# Altium schematic sheet 600W INV MCU-1.SchDoc
size 431 x 304 mm
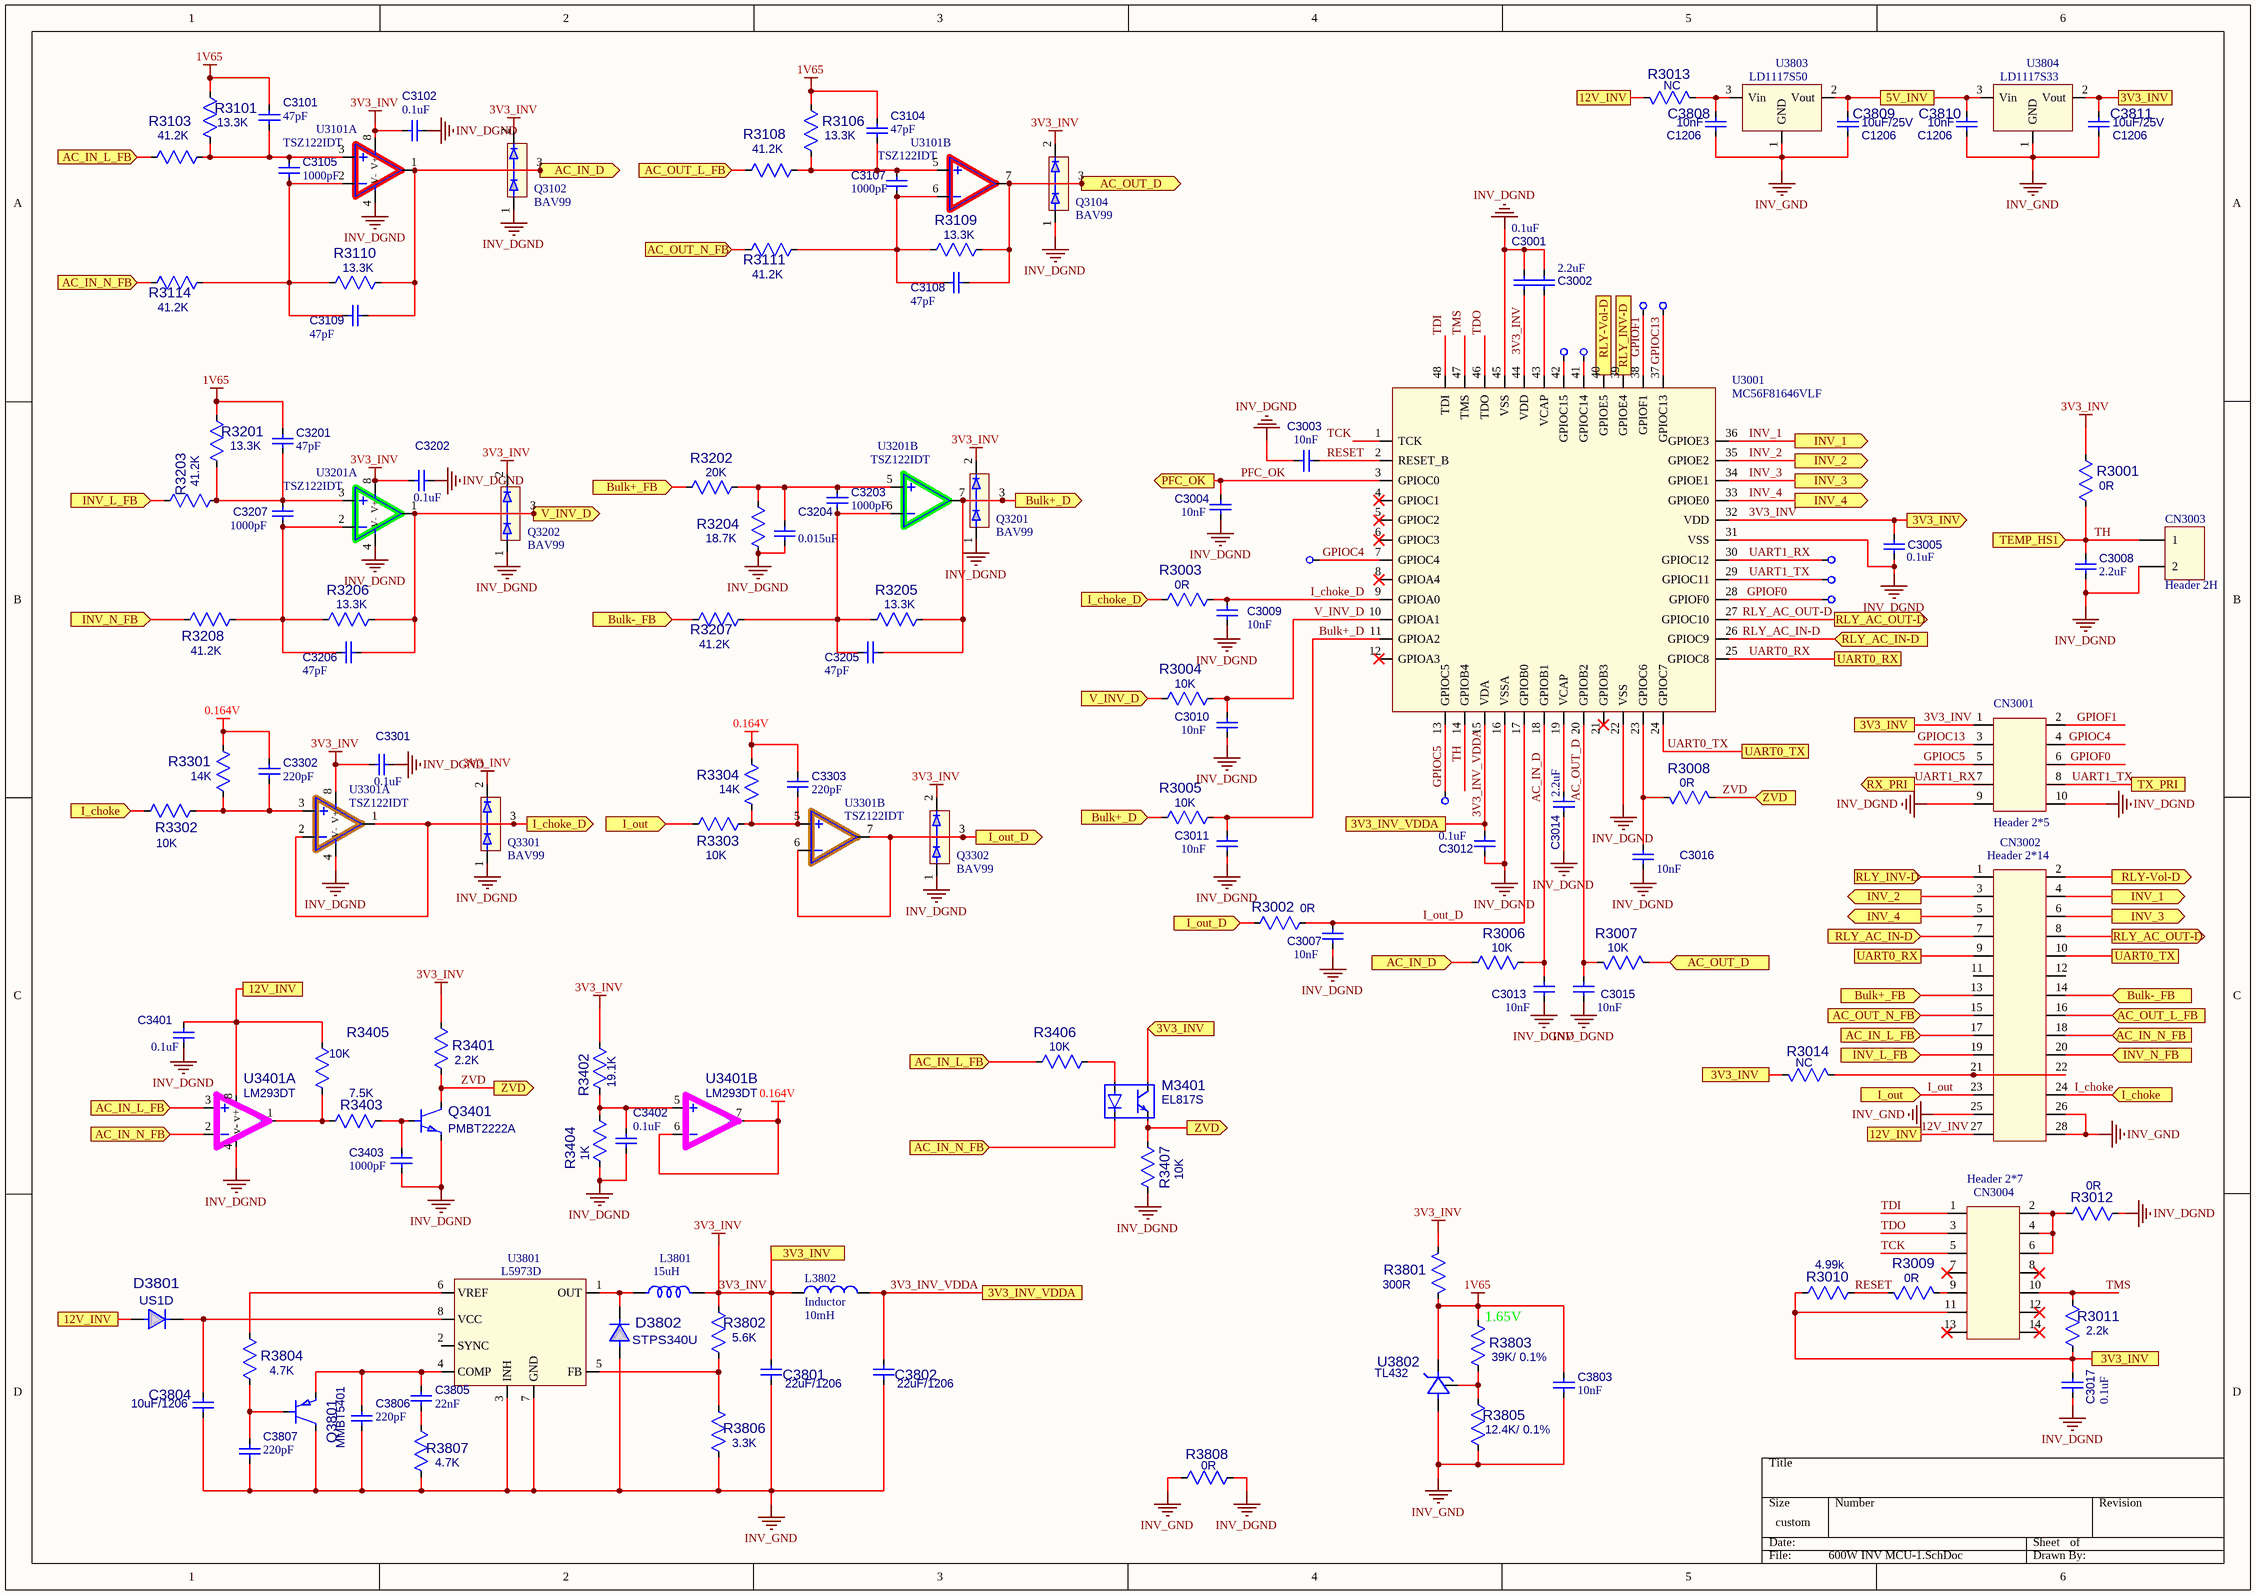
[diagram p0: 600W INV MCU-1.SchDoc]

## Parts
C3001  0.1uF  [C0603L]
C3002  2.2uF  [C0603L]
C3003  10nF  [C0603L]
C3004  10nF  [C0603L]
C3005  0.1uF  [C0603L]
C3007  10nF  [C0603L]
C3008  2.2uF  [C0603L]
C3009  10nF  [C0603L]
C3010  10nF  [C0603L]
C3011  10nF  [C0603L]
C3012  0.1uF  [C0603L]
C3013  10nF  [C0603L]
C3014  2.2uF  [C0603L]
C3015  10nF  [C0603L]
C3016  10nF  [C0603L]
C3017  0.1uF  [C0603L]
C3101  47pF  [C0603L]
C3102  0.1uF  [C0603L]
C3104  47pF  [C0603L]
C3105  1000pF  [C0603L]
C3107  1000pF  [C0603L]
C3108  47pF  [C0603L]
C3109  47pF  [C0603L]
C3201  47pF  [C0603L]
C3202  0.1uF  [C0603L]
C3203  1000pF  [C0603L]
C3204  0.015uF  [C0603L]
C3205  47pF  [C0603L]
C3206  47pF  [C0603L]
C3207  1000pF  [C0603L]
C3301  0.1uF  [C0603L]
C3302  220pF  [C0603L]
C3303  220pF  [C0603L]
C3401  0.1uF  [C0603L]
C3402  0.1uF  [C0603L]
C3403  1000pF  [C0603L]
C3801  22uF/1206  [C1206]
C3802  22uF/1206  [C1206]
C3803  10nF  [C0603L]
C3804  10uF/1206  [C1206]
C3805  22nF  [C0603L]
C3806  220pF  [C0603L]
C3807  220pF  [C0603L]
C3808  10nF  [C1206]
C3809  10uF/25V  [C1206]
C3810  10nF  [C1206]
C3811  10uF/25V  [C1206]
CN3001  Header 2*5  [HDR2X5]
CN3002  Header 2*14  [HDR2X14H]
CN3003  Header 2H  [HDR1X2H]
CN3004  Header 2*7  [HDR2X7]
D3801  US1D  [SMA]
D3802  STPS340U  [SMB]
L3801  15uH  [L-6*6]
L3802  Inductor  value 10mH  [R0603L]
M3401  EL817S  [PHOTO-PS2561DLA]
Q3102  BAV99  [SOT23]
Q3104  BAV99  [SOT23]
Q3201  BAV99  [SOT23]
Q3202  BAV99  [SOT23]
Q3301  BAV99  [SOT23]
Q3302  BAV99  [SOT23]
Q3401  PMBT2222A  [SOT23-CBE]
Q3801  MMBT5401  [SOT23]
R3001  0R  [R0603L]
R3002  0R  [R0603L]
R3003  0R  [R0603L]
R3004  10K  [R0603L]
R3005  10K  [R0603L]
R3006  10K  [R0603L]
R3007  10K  [R0603L]
R3008  0R  [R0603L]
R3009  0R  [R0603L]
R3010  4.99k  [R0603L]
R3011  2.2k  [R0603L]
R3012  0R  [R0603L]
R3013  NC  [R0603L]
R3014  NC  [R0603L]
R3101  13.3K  [R0603L]
R3103  41.2K  [R0603L]
R3106  13.3K  [R0603L]
R3108  41.2K  [R0603L]
R3109  13.3K  [R0603L]
R3110  13.3K  [R0603L]
R3111  41.2K  [R0603L]
R3114  41.2K  [R0603L]
R3201  13.3K  [R0603L]
R3202  20K  [R0603L]
R3203  41.2K  [R0603L]
R3204  18.7K  [R0603L]
R3205  13.3K  [R0603L]
R3206  13.3K  [R0603L]
R3207  41.2K  [R0603L]
R3208  41.2K  [R0603L]
R3301  14K  [R0603L]
R3302  10K  [R0603L]
R3303  10K  [R0603L]
R3304  14K  [R0603L]
R3401  2.2K  [R0603L]
R3402  19.1K  [R0603L]
R3403  7.5K  [R0603L]
R3404  1K  [R0603L]
R3405  10K  [R0603L]
R3406  10K  [R0603L]
R3407  10K  [R0603L]
R3801  300R  [R0603L]
R3802  5.6K  [R0603L]
R3803  39K/ 0.1%  [R0603L]
R3804  4.7K  [R0603L]
R3805  12.4K/ 0.1%  [R0603L]
R3806  3.3K  [R0603L]
R3807  4.7K  [R0603L]
R3808  0R  [R1206]
TP3001  TIENET  [TP]  (value not drawn)  (net tie, no BOM)
TP3002  TIENET  [TP]  (value not drawn)  (net tie, no BOM)
TP3003  TIENET  [TP]  (value not drawn)  (net tie, no BOM)
TP3004  TIENET  [TP]  (value not drawn)  (net tie, no BOM)
TP3005  TIENET  [TP]  (value not drawn)  (net tie, no BOM)
TP3006  TIENET  [TP]  (value not drawn)  (net tie, no BOM)
TP3007  TIENET  [TP]  (value not drawn)  (net tie, no BOM)
TP3008  TIENET  [TP]  (value not drawn)  (net tie, no BOM)
TP3010  TIENET  [TP]  (value not drawn)  (net tie, no BOM)
U3001  MC56F81646VLF  [LQFP-48]
U3101  TSZ122IDT  [SO8]  (parts A,B of 2)
U3201  TSZ122IDT  [SO8]  (parts A,B of 2)
U3301  TSZ122IDT  [SO8]  (parts A,B of 2)
U3401  LM293DT  [SO8]  (parts A,B of 2)
U3801  L5973D  [HSOP8]
U3802  TL432  [SOT23]
U3803  LD1117S50  [SOT223]
U3804  LD1117S33  [SOT223]

## Ports
3V3_INV, 3V3_INV (in), 3V3_INV (out), 3V3_INV_VDDA, 5V_INV, 12V_INV, AC_IN_D (in), AC_IN_D (out), AC_IN_L_FB (in), AC_IN_N_FB (in), AC_OUT_D (in), AC_OUT_D (out), AC_OUT_L_FB (in), AC_OUT_N_FB (in), Bulk+_D (in), Bulk+_D (out), Bulk+_FB (in), Bulk-_FB (in), I_choke (in), I_choke_D (in), I_choke_D (out), I_out (in), I_out_D (in), I_out_D (out), INV_1 (out), INV_2 (out), INV_3 (out), INV_4 (out), INV_L_FB (in), INV_N_FB (in), PFC_OK (out), RLY-Vol-D (in), RLY-Vol-D (out), RLY_AC_IN-D (in), RLY_AC_OUT-D (out), RLY_INV-D (in), RX_PRI (out), TEMP_HS1 (in), TX_PRI, UART0_RX, UART0_TX, V_INV_D (in), V_INV_D (out), ZVD (in), ZVD (out)

## Nets
0.164V: C3302.2 C3303.2 R3301.1 R3304.1 U3401.6(-) U3401.7(out)
1V65: C3101.2 C3104.2 C3201.2 C3803.2 R3101.1 R3106.1 R3201.1 R3801.2 R3803.2 U3802.1(C)
3V3_INV: C3001.2 C3005.2 C3017.2 C3102.1 C3202.1 C3301.1 C3801.1 C3811.1 CN3001.1 CN3004.11 L3801.2 L3802.1 M3401.4 Q3102.2 Q3104.2 Q3201.2 Q3202.2 Q3301.2 Q3302.2 R3001.1 R3010.2 R3011.2 R3014.2 R3401.2 R3402.1 R3801.1 R3802.2 U3001.32(VDD) U3001.44(VDD) U3101.8(V+) U3201.8(V+) U3301.8(V+) U3804.2(Vout) ; port 3V3_INV
INV_DGND: C3001.1 C3002.1 C3003.1 C3004.1 C3005.1 C3007.1 C3008.1 C3009.1 C3010.1 C3011.1 C3012.1 C3013.1 C3014.1 C3015.1 C3016.1 C3017.1 C3102.2 C3202.2 C3204.1 C3301.2 C3401.2 C3402.1 C3403.1 CN3001.9 CN3001.10 CN3003.2 Q3102.1 Q3104.1 Q3201.1 Q3202.1 Q3301.1 Q3302.1 Q3401.E R3012.2 R3204.2 R3404.2 R3407.1 R3808.2 U3001.16(VSSA) U3001.22(VSS) U3001.31(VSS) U3001.45(VSS) U3101.4(V-) U3201.4(V-) U3301.4(V-) U3401.4(v-)
INV_GND: C3801.2 C3802.2 C3803.1 C3804.2 C3806.2 C3807.2 C3808.2 C3809.2 C3810.2 C3811.2 CN3002.25 CN3002.26 CN3002.28 D3802.A Q3801.3(C) R3805.1 R3806.1 R3807.1 R3808.1 U3801.3(INH) U3801.7(GND) U3802.3(A) U3803.1(GND) U3804.1(GND)
3V3_INV_VDDA: C3012.2 C3802.1 L3802.2 U3001.15(VDA) ; port 3V3_INV_VDDA
5V_INV: C3809.1 C3810.1 U3803.2(Vout) U3804.3(Vin) ; port 5V_INV
12V_INV: C3401.1 CN3002.27 D3801.A R3013.2 R3405.2 U3401.8(v+) ; port 12V_INV
AC_IN_D: C3013.2 R3006.2 U3001.18(GPIOB1)
AC_IN_D: C3109.1 Q3102.3 R3006.1 R3110.2 U3101.1(OUT) ; port AC_IN_D  [a separate net that carries the same name]
AC_IN_L_FB: CN3002.17 R3103.1 R3406.1 U3401.3(+) ; port AC_IN_L_FB
AC_IN_N_FB: CN3002.18 M3401.2 R3114.1 U3401.2(-) ; port AC_IN_N_FB
AC_OUT_D: C3015.2 R3007.2 U3001.20(GPIOB2)
AC_OUT_D: C3108.1 Q3104.3 R3007.1 R3109.2 U3101.7(OUT) ; port AC_OUT_D  [a separate net that carries the same name]
AC_OUT_L_FB: CN3002.16 R3108.1 ; port AC_OUT_L_FB
AC_OUT_N_FB: CN3002.15 R3111.1 ; port AC_OUT_N_FB
Bulk+_D: C3011.2 R3005.2 U3001.11(GPIOA2)
Bulk+_D: C3205.1 Q3201.3 R3005.1 R3205.2 U3201.7(OUT) ; port Bulk+_D  [a separate net that carries the same name]
Bulk+_FB: CN3002.13 R3202.1 ; port Bulk+_FB
Bulk-_FB: CN3002.14 R3207.1 ; port Bulk-_FB
GPIOC4: CN3001.4 TP3008.1 U3001.7(GPIOC4)
GPIOC5: CN3001.5 TP3010.1 U3001.13(GPIOC5)
GPIOC13: CN3001.3 TP3002.1 U3001.37(GPIOC13)
GPIOF0: CN3001.6 TP3007.1 U3001.28(GPIOF0)
GPIOF1: CN3001.2 TP3001.1 U3001.38(GPIOF1)
I_choke: CN3002.24 R3302.1 ; port I_choke
I_choke_D: C3009.2 R3003.2 U3001.9(GPIOA0)
I_choke_D: Q3301.3 R3003.1 U3301.1(OUT) U3301.2(-IN) ; port I_choke_D  [a separate net that carries the same name]
I_out: CN3002.23 R3303.1 ; port I_out
I_out_D: C3007.2 R3002.2 U3001.17(GPIOB0)
I_out_D: Q3302.3 R3002.1 U3301.6(-IN) U3301.7(OUT) ; port I_out_D  [a separate net that carries the same name]
INV_1: CN3002.4 U3001.36(GPIOE3) ; port INV_1
INV_2: CN3002.3 U3001.35(GPIOE2) ; port INV_2
INV_3: CN3002.6 U3001.34(GPIOE1) ; port INV_3
INV_4: CN3002.5 U3001.33(GPIOE0) ; port INV_4
INV_L_FB: CN3002.19 R3203.1 ; port INV_L_FB
INV_N_FB: CN3002.20 R3208.1 ; port INV_N_FB
PFC_OK: C3004.2 U3001.3(GPIOC0) ; port PFC_OK
RESET: C3003.2 R3009.2 R3010.1 U3001.2(RESET_B)
RLY-Vol-D: CN3002.2 U3001.40(GPIOE5) ; port RLY-Vol-D
RLY_AC_IN-D: CN3002.7 U3001.26(GPIOC9) ; port RLY_AC_IN-D
RLY_AC_OUT-D: CN3002.8 U3001.27(GPIOC10) ; port RLY_AC_OUT-D
RLY_INV-D: CN3002.1 U3001.39(GPIOE4) ; port RLY_INV-D
TCK: CN3004.5 U3001.1(TCK)
TDI: CN3004.1 U3001.48(TDI)
TDO: CN3004.3 U3001.46(TDO)
TH: C3008.2 CN3003.1 R3001.2 U3001.14(GPIOB4) ; port TEMP_HS1
TMS: CN3004.10 R3011.1 U3001.47(TMS)
UART0_RX: CN3002.9 U3001.25(GPIOC8) ; port UART0_RX
UART0_TX: CN3002.10 U3001.24(GPIOC7) ; port UART0_TX
UART1_RX: CN3001.7 TP3005.1 U3001.30(GPIOC12) ; port RX_PRI
UART1_TX: CN3001.8 TP3006.1 U3001.29(GPIOC11) ; port TX_PRI
V_INV_D: C3010.2 R3004.2 U3001.10(GPIOA1)
V_INV_D: C3206.1 Q3202.3 R3004.1 R3206.2 U3201.1(OUT) ; port V_INV_D  [a separate net that carries the same name]
ZVD: M3401.3 Q3401.C R3008.1 R3401.1 R3407.2 ; port ZVD
NetC3002_2: C3002.2 U3001.43(VCAP)
NetC3014_2: C3014.2 U3001.19(VCAP)
NetC3016_2: C3016.2 R3008.2 U3001.23(GPIOC6)
NetC3101_1: C3101.1 C3105.2 R3101.2 R3103.2 U3101.3(+IN)
NetC3104_1: C3104.1 C3107.2 R3106.2 R3108.2 U3101.5(+IN)
NetC3105_1: C3105.1 C3109.2 R3110.1 R3114.2 U3101.2(-IN)
NetC3107_1: C3107.1 C3108.2 R3109.1 R3111.2 U3101.6(-IN)
NetC3201_1: C3201.1 C3207.2 R3201.2 R3203.2 U3201.3(+IN)
NetC3203_1: C3203.1 C3205.2 R3205.1 R3207.2 U3201.6(-IN)
NetC3203_2: C3203.2 C3204.2 R3202.2 R3204.1 U3201.5(+IN)
NetC3206_2: C3206.2 C3207.1 R3206.1 R3208.2 U3201.2(-IN)
NetC3302_1: C3302.1 R3301.2 R3302.2 U3301.3(+IN)
NetC3303_1: C3303.1 R3303.2 R3304.2 U3301.5(+IN)
NetC3402_2: C3402.2 R3402.2 R3404.1 U3401.5(+)
NetC3403_2: C3403.2 Q3401.B R3403.1
NetC3804_1: C3804.1 D3801.K U3801.8(VCC)
NetC3805_1: C3805.1 C3806.1 Q3801.2(E) U3801.4(COMP)
NetC3805_2: C3805.2 R3807.2
NetC3807_1: C3807.1 Q3801.1(B) R3804.1
NetC3808_1: C3808.1 R3013.1 U3803.3(Vin)
NetCN3002_21: CN3002.21 CN3002.22 R3014.1
NetCN3004_2: CN3004.2 CN3004.4 CN3004.6 R3012.1
NetCN3004_9: CN3004.9 R3009.1
NetD3802_K: D3802.K L3801.1 U3801.1(OUT)
NetM3401_1: M3401.1 R3406.2
NetR3403_2: R3403.2 R3405.1 U3401.1(out)
NetR3802_1: R3802.1 R3806.2 U3801.5(FB)
NetR3803_1: R3803.1 R3805.2 U3802.2(R)
NetR3804_2: R3804.2 U3801.6(VREF)
NetTP3003_1: TP3003.1 U3001.42(GPIOC15)
NetTP3004_1: TP3004.1 U3001.41(GPIOC14)

Not connected (* = marked no-connect by the designer): CN3002 11 12; CN3004 7* 8* 12* 13* 14*; U3001 4(GPIOC1)* 5(GPIOC2)* 6(GPIOC3)* 8(GPIOA4)* 12(GPIOA3)* 21(GPIOB3)*; U3401 15 16 17 18; U3801 2(SYNC)

## Notes on the sheet
- (near R3803) 1.65V

## Library data of the parts
C3001-C3005 C3007-C3017 C3101 C3102 C3104 C3105 C3107-C3109 C3201-C3207 C3301-C3303 C3401-C3403 C3803 C3805-C3807 = C0603: package: C0603; OPEN: OPEN
C3801 C3802 C3804 C3808-C3811 = C1206: package: C1206
CN3001 = Header 2*5: PCB Footprint: CONP10
CN3002 = Header 2*14: PCB Footprint: CONP10
CN3003 = Header 2H: Header, 2 Pin, Right Angle; LatestRevisionDate: 17-Jul-2002; LatestRevisionNote: Re-released for DXP Platform.; Publisher: Altium Limited
CN3004 = Header 2*7: PCB Footprint: CONP10
D3801 D3802 = Diode: ALL FOOTPRINT; package: SOD123
L3801 = L: Vendor: SHUNYUE; name: Inductor; miao: 150uH,※I§倰ㄛT6*10,耳=0.5*1
L3802 = Inductor: Code_IEC: 1005; Published: 8-Jun-2000; LatestRevisionDate: 29-May-2009; LatestRevisionNote: IPC-7351 Footprint Added.; PackageReference: 0402-A; Publisher: Altium Limited; PackageDescription: Chip Inductor; Code_JEITA: 0402
M3401 = PHOTO-PS2561DLA: PackageOutlineLayer: 2mm; Value: {Value}; ModifyDate: 06/28/2010 14:14:37; SubKind: *; VEN: *; VENPN: *; PartNumber: *; S3: *; S2: *; S1: *; DSC: *; DESC: *; S5: *; ComponentHeight: 2mm
Q3401 = NPN: SOT-23-NPN; package: SOT-23; PartNumber: *
Q3801 = PNP: SOT-23-PNP; package: SOT-23
R3001-R3014 R3101 R3103 R3106 R3108-R3111 R3114 R3201-R3208 R3301-R3304 R3401-R3407 R3801-R3807 = R0603: package: R0603
R3808 = R1206: package: R1206
TP3001-TP3008 TP3010 = TP: TIENET0D5; Value: {Value}; PackageOutlineLayer: Top Assy; SubKind: *; VEN: *; VENPN: *; PartNumber: *; ModifyDate: 10/31/2007 15:58:16; S3: *; S2: *; S1: *; DSC: *; DESC: *; S5: *; ComponentHeight: *
U3401 = LM393: Value: {Value}; Package: SO-8
U3802 = TL431: Package: SOT-23
U3803 U3804 = LD1117: Partnumber: *; Vender: *
U3001 = MC56F81646VLF: Vender: *